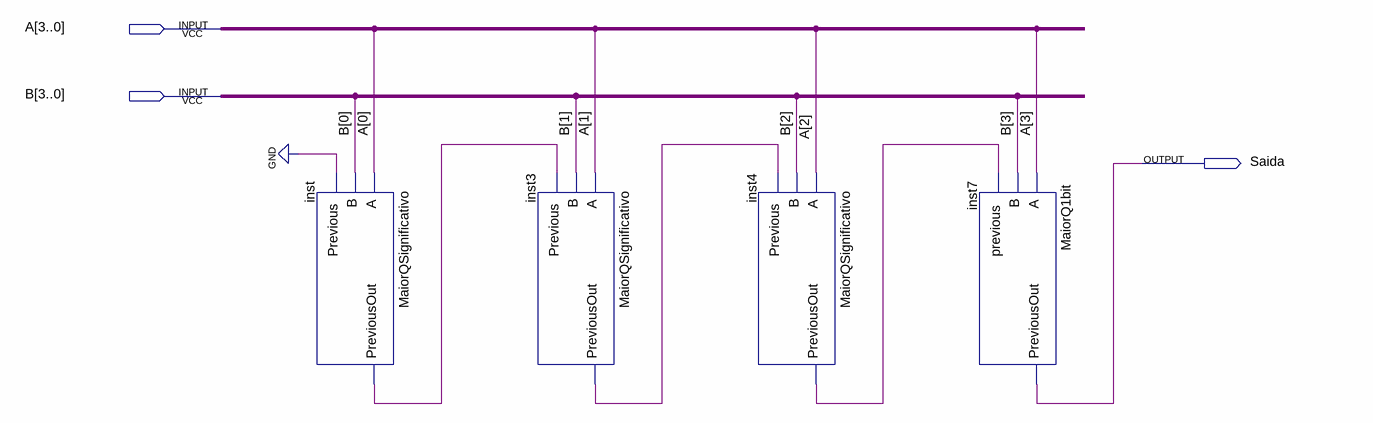
[diagram p0: schematic sheet]
// Quartus schematic ComparadorMenorQVetor.bdf as structural Verilog: 4 symbols, 3 pins
module ComparadorMenorQVetor (
  input  [3:0] A,
  input  [3:0] B,
  output Saida
);

  wire inst3_previousout, inst4_previousout, inst_previousout;

  MaiorQSignificativo inst (.A(A[0]), .B(B[0]), .Previous(1'b0), .PreviousOut(inst_previousout));
  MaiorQSignificativo inst3 (.A(A[1]), .B(B[1]), .Previous(inst_previousout), .PreviousOut(inst3_previousout));
  MaiorQSignificativo inst4 (.A(A[2]), .B(B[2]), .Previous(inst3_previousout), .PreviousOut(inst4_previousout));
  MaiorQ1bit inst7 (.A(A[3]), .B(B[3]), .previous(inst4_previousout), .PreviousOut(Saida));
endmodule
